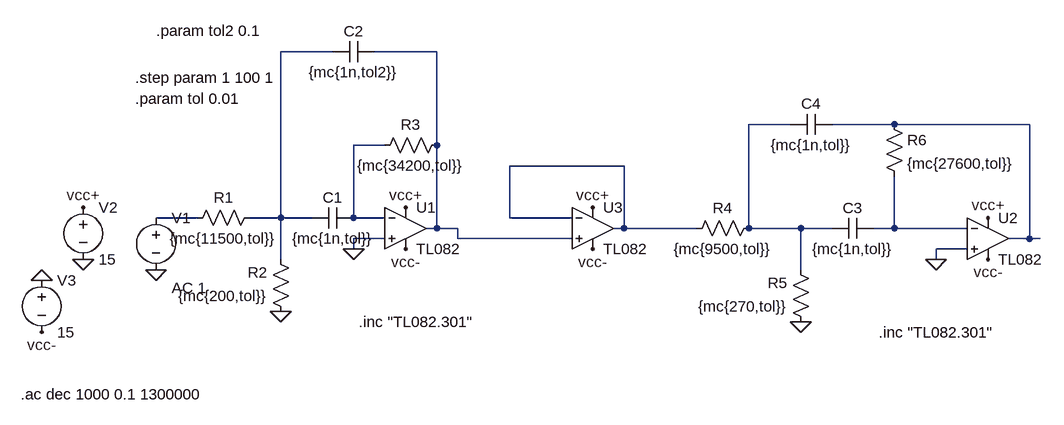
[diagram p0: schematic Funciona.asc]
Funciona.asc, the LTspice schematic file:
Version 4
SHEET 1 1264 680
WIRE 160 -112 80 -112
WIRE 320 -112 224 -112
WIRE 864 0 800 0
WIRE 1024 0 928 0
WIRE 1232 0 1024 0
WIRE 240 32 192 32
WIRE 320 32 320 -112
WIRE 608 64 432 64
WIRE -48 144 -112 144
WIRE 80 144 80 -112
WIRE 80 144 32 144
WIRE 128 144 80 144
WIRE 192 144 192 32
WIRE 240 144 192 144
WIRE 432 144 432 64
WIRE 528 144 432 144
WIRE 320 160 320 32
WIRE 320 160 304 160
WIRE 352 160 320 160
WIRE 608 160 608 64
WIRE 608 160 592 160
WIRE 720 160 608 160
WIRE 800 160 800 0
WIRE 880 160 800 160
WIRE 928 160 880 160
WIRE 1024 160 1024 80
WIRE 1024 160 992 160
WIRE 1136 160 1024 160
WIRE 240 176 192 176
WIRE 352 176 352 160
WIRE 528 176 352 176
WIRE 1232 176 1232 0
WIRE 1232 176 1200 176
WIRE 1248 176 1232 176
WIRE 192 192 192 176
WIRE 1136 192 1088 192
WIRE 80 208 80 144
WIRE 1088 208 1088 192
WIRE 880 224 880 160
FLAG 192 192 0
FLAG 80 288 0
FLAG -112 224 0
FLAG 272 128 vcc+
FLAG 272 192 vcc-
FLAG -224 208 0
FLAG -288 240 0
FLAG -224 128 vcc+
FLAG -288 320 vcc-
FLAG 1088 208 0
FLAG 880 304 0
FLAG 1168 144 vcc+
FLAG 1168 208 vcc-
FLAG 560 128 vcc+
FLAG 560 192 vcc-
SYMBOL res 48 128 R90
WINDOW 0 0 56 VBottom 2
WINDOW 3 32 56 VTop 2
SYMATTR InstName R1
SYMATTR Value {mc{11500,tol}}
SYMBOL res 96 304 R180
WINDOW 0 36 76 Left 2
WINDOW 3 36 40 Left 2
SYMATTR InstName R2
SYMATTR Value {mc{200,tol}}
SYMBOL res 224 48 R270
WINDOW 0 32 56 VTop 2
WINDOW 3 0 56 VBottom 2
SYMATTR InstName R3
SYMATTR Value {mc{34200,tol}}
SYMBOL cap 192 128 R90
WINDOW 0 0 32 VBottom 2
WINDOW 3 32 32 VTop 2
SYMATTR InstName C1
SYMATTR Value {mc{1n,tol}}
SYMBOL cap 224 -128 R90
WINDOW 0 0 32 VBottom 2
WINDOW 3 32 32 VTop 2
SYMATTR InstName C2
SYMATTR Value {mc{1n,tol2}}
SYMBOL Opamps\\opamp2 272 96 R0
SYMATTR InstName U1
SYMATTR Value TL082
SYMBOL voltage -112 128 R0
WINDOW 123 24 124 Left 2
WINDOW 39 0 0 Left 2
SYMATTR Value2 AC 1
SYMATTR InstName V1
SYMATTR Value ""
SYMBOL voltage -224 112 R0
SYMATTR InstName V2
SYMATTR Value 15
SYMBOL voltage -288 224 R0
SYMATTR InstName V3
SYMATTR Value 15
SYMBOL res 816 144 R90
WINDOW 0 0 56 VBottom 2
WINDOW 3 32 56 VTop 2
SYMATTR InstName R4
SYMATTR Value {mc{9500,tol}}
SYMBOL res 896 320 R180
WINDOW 0 36 76 Left 2
WINDOW 3 36 40 Left 2
SYMATTR InstName R5
SYMATTR Value {mc{270,tol}}
SYMBOL res 1008 -16 R0
SYMATTR InstName R6
SYMATTR Value {mc{27600,tol}}
SYMBOL cap 992 144 R90
WINDOW 0 0 32 VBottom 2
WINDOW 3 32 32 VTop 2
SYMATTR InstName C3
SYMATTR Value {mc{1n,tol}}
SYMBOL cap 928 -16 R90
WINDOW 0 0 32 VBottom 2
WINDOW 3 32 32 VTop 2
SYMATTR InstName C4
SYMATTR Value {mc{1n,tol}}
SYMBOL Opamps\\opamp2 1168 112 R0
SYMATTR InstName U2
SYMATTR Value TL082
SYMBOL Opamps\\opamp2 560 96 R0
SYMATTR InstName U3
SYMATTR Value TL082
TEXT 200 304 Left 2 !.inc "TL082.301"
TEXT -320 416 Left 2 !.ac dec 1000 0.1 1300000
TEXT 1000 320 Left 2 !.inc "TL082.301"
TEXT -144 -40 Left 2 !.param tol 0.01
TEXT -144 -72 Left 2 !.step param 1 100 1
TEXT -112 -144 Left 2 !.param tol2 0.1

The netlist it stands for:
* Funciona.asc
R1 N001 N007 {mc{11500,tol}}
R2 0 N001 {mc{200,tol}}
R3 N005 N002 {mc{34200,tol}}
C1 N005 N001 {mc{1n,tol}}
C2 N002 N001 {mc{1n,tol2}}
XU1 0 N005 vcc+ vcc- N002 TL082  ; pins In+ In- V+ V- OUT
V1 N007 0 AC 1
V2 vcc+ 0 15
V3 0 vcc- 15
R4 N003 N006 {mc{9500,tol}}
R5 0 N003 {mc{270,tol}}
R6 N004 N008 {mc{27600,tol}}
C3 N008 N003 {mc{1n,tol}}
C4 N004 N003 {mc{1n,tol}}
XU2 0 N008 vcc+ vcc- N004 TL082  ; pins In+ In- V+ V- OUT
XU3 N002 N006 vcc+ vcc- N006 TL082  ; pins In+ In- V+ V- OUT
.inc "TL082.301"
.ac dec 1000 0.1 1300000
.inc "TL082.301"
.param tol 0.01
.step param 1 100 1
.param tol2 0.1
.backanno
.end